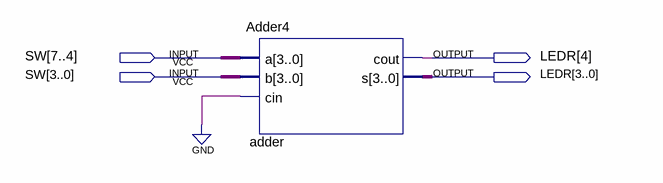
[diagram p0: schematic sheet]
// Quartus schematic AdderDemo.bdf as structural Verilog: 1 symbols, 4 pins
module AdderDemo (
  input  [7:0] SW,
  output [4:0] LEDR
);

  Adder4 adder (.a(SW[7:4]), .b(SW[3:0]), .cin(1'b0), .cout(LEDR[4]), .s(LEDR[3:0]));
endmodule
